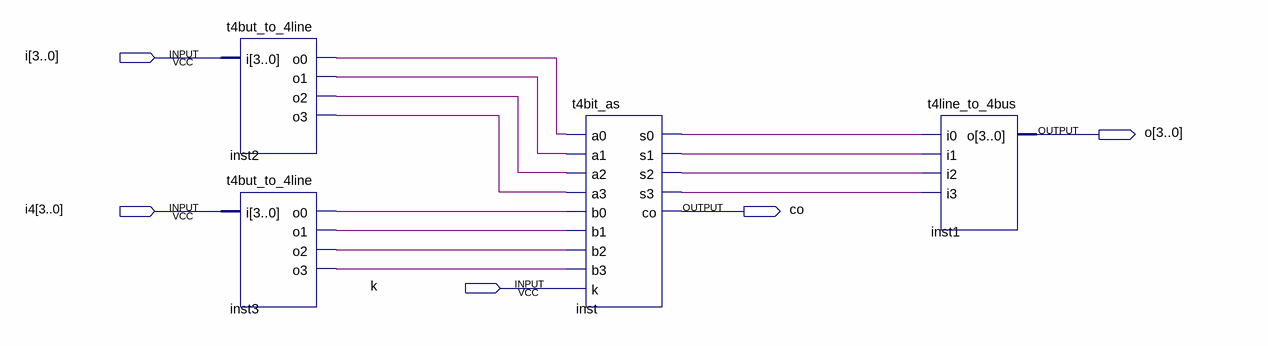
[diagram p0: schematic sheet]
// Quartus schematic t4bits_bus_as.bdf as structural Verilog: 4 symbols, 5 pins
module t4bits_bus_as (
  input  [3:0] i,
  input  [3:0] i4,
  input  k,
  output [3:0] o,
  output co
);

  wire inst2_o0, inst2_o1, inst2_o2, inst2_o3, inst3_o0, inst3_o1, inst3_o2, inst3_o3, inst_s0, inst_s1,
       inst_s2, inst_s3;

  t4but_to_4line inst2 (.i(i), .o0(inst2_o0), .o1(inst2_o1), .o2(inst2_o2), .o3(inst2_o3));
  t4but_to_4line inst3 (.i(i4), .o0(inst3_o0), .o1(inst3_o1), .o2(inst3_o2), .o3(inst3_o3));
  t4bit_as inst (
    .a0(inst2_o0), .a1(inst2_o1), .a2(inst2_o2), .a3(inst2_o3), .b0(inst3_o0), .b1(inst3_o1), .b2(inst3_o2),
    .b3(inst3_o3), .k(k), .s0(inst_s0), .s1(inst_s1), .s2(inst_s2), .s3(inst_s3), .co(co));
  t4line_to_4bus inst1 (.i0(inst_s0), .i1(inst_s1), .i2(inst_s2), .i3(inst_s3), .o(o));
endmodule
